# Altium schematic sheet 28Pins_Schematic.SchDoc
size A4
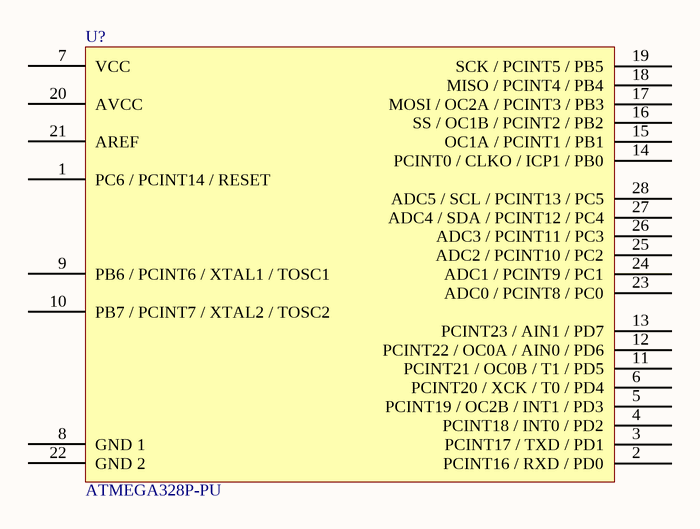
[diagram p0: 28Pins_Schematic.SchDoc]

## Parts
U?  ATMEGA328P-PU  [28_DIP_7.62mm]

## Nets

Not connected (* = marked no-connect by the designer): U? 1(PC6_/_PCINT14_/_RESET_) 2(PCINT16_/_RXD_/_PD0) 3(PCINT17_/_TXD_/_PD1) 4(PCINT18_/_INT0_/_PD2) 5(PCINT19_/_OC2B_/_INT1_/_PD3) 6(PCINT20_/_XCK_/_T0_/_PD4) 7(VCC) 8(GND_1) 9(PB6_/_PCINT6_/_XTAL1_/_TOSC1) 10(PB7_/_PCINT7_/_XTAL2_/_TOSC2) 11(PCINT21_/_OC0B_/_T1_/_PD5) 12(PCINT22_/_OC0A_/_AIN0_/_PD6) 13(PCINT23_/_AIN1_/_PD7) 14(PCINT0_/_CLKO_/_ICP1_/_PB0) 15(OC1A_/_PCINT1_/_PB1) 16(SS_/_OC1B_/_PCINT2_/_PB2) 17(MOSI_/_OC2A_/_PCINT3_/_PB3) 18(MISO_/_PCINT4_/_PB4) 19(SCK_/_PCINT5_/_PB5) 20(AVCC) 21(AREF) 22(GND_2) 23(ADC0_/_PCINT8_/_PC0) 24(ADC1_/_PCINT9_/_PC1) 25(ADC2_/_PCINT10_/_PC2) 26(ADC3_/_PCINT11_/_PC3) 27(ADC4_/_SDA_/_PCINT12_/_PC4) 28(ADC5_/_SCL_/_PCINT13_/_PC5)

## Library data of the parts
U? = ATMEGA328P-PU: ATMEL         ATMEGA328P-PU            8 Bit Microcontroller, Low Power High Performance, ATmega, 20 MHz, 32 KB, 2 KB, 28 Pins, DIP; Manufacturer: Microchip / Atmel; Core Architecture: AVR; RAM Size: 2KB; Number of PWM Channels: 6; Number of Timers/Counters: 3; Min Supply Voltage: 1.8V; Max Supply Voltage: 5.5V; Interface: I2C,SPI,UART,USART,2-Wire; Number of I/Os: 23; Frequency: 20MHz; Oscillator Type: Internal; Data Bus Width: 8b; Number of SPI Channels: 1; Watchdog Timer: Yes; Memory Type: FLASH; Memory Size: 32KB; Peripherals: Brown-out Detect/Reset,POR,PWM,WDT; Supplier 1: Digi-Key; Manufacturer Part Number: ATMEGA328P-PU; RoHS: Yes; Category: Microcontrollers; Stock 1: 910; Pricing 1: 1=2.08000, 25=1.91000, 100=1.73000 (USD); Mount: Through Hole; Case/Package: PDIP; Number of Pins: 28; Contact Plating: Tin,Matte; Min Operating Temperature: -40°C; Max Operating Temperature: 85°C; Package Quantity: 14; Number of ADC Channels: 6; Packaging: Rail/Tube; Number of Programmable I/O: 23; Max Frequency: 20MHz; Number of I2C Channels: 1; Length: 37.4mm; Height: 3.28mm; Width: 6.76mm; Radiation Hardening: No; REACH SVHC: No SVHC; Lead Free: Lead Free; ComponentLink1URL: https://datasheet.ciiva.com/1157/1684409-1157696.pdf?src-supplier=Element14; ComponentLink1Description: https://datasheet.ciiva.com/1157/1684409-1157696.pdf?src-supplier=Element14; ComponentLink2URL: https://datasheet.ciiva.com/20168/73-4283-20168380.pdf?src-supplier=Rapid+Electronics; ComponentLink2Description: https://datasheet.ciiva.com/20168/73-4283-20168380.pdf?src-supplier=Rapid+Electronics; ComponentLink3URL: https://datasheet.ciiva.com/19457/2139111-19457070.pdf?src-supplier=Jameco; ComponentLink3Description: https://datasheet.ciiva.com/19457/2139111-19457070.pdf?src-supplier=Jameco; ComponentLink4URL: https://datasheet.ciiva.com/26818/atmega328p-pu-26818578.pdf?src-supplier=IIIC; ComponentLink4Description: https://datasheet.ciiva.com/26818/atmega328p-pu-26818578.pdf?src-supplier=IIIC; ComponentLink5URL: https://datasheet.ciiva.com/29119/155197-da-01-en-microcontr-atmega328p-pu-8bit-pdip-28-29119593.pdf?src-supplier=Conrad; ComponentLink5Description: https://datasheet.ciiva.com/29119/155197-da-01-en-microcontr-atmega328p-pu-8bit-pdip-28-29119593.pdf?src-supplier=Conrad; ComponentLink6URL: https://datasheet.ciiva.com/15213/getdatasheetpartid-318533-15213133.pdf?src-supplier=Verical; ComponentLink6Description: https://datasheet.ciiva.com/15213/getdatasheetpartid-318533-15213133.pdf?src-supplier=Verical; Supplier Part Number 1: ATMEGA328P-PU-ND